# Altium schematic sheet Output_dig.SchDoc
size A4; DocumentNumber: 2; SheetNumber: 2; SheetTotal: 11
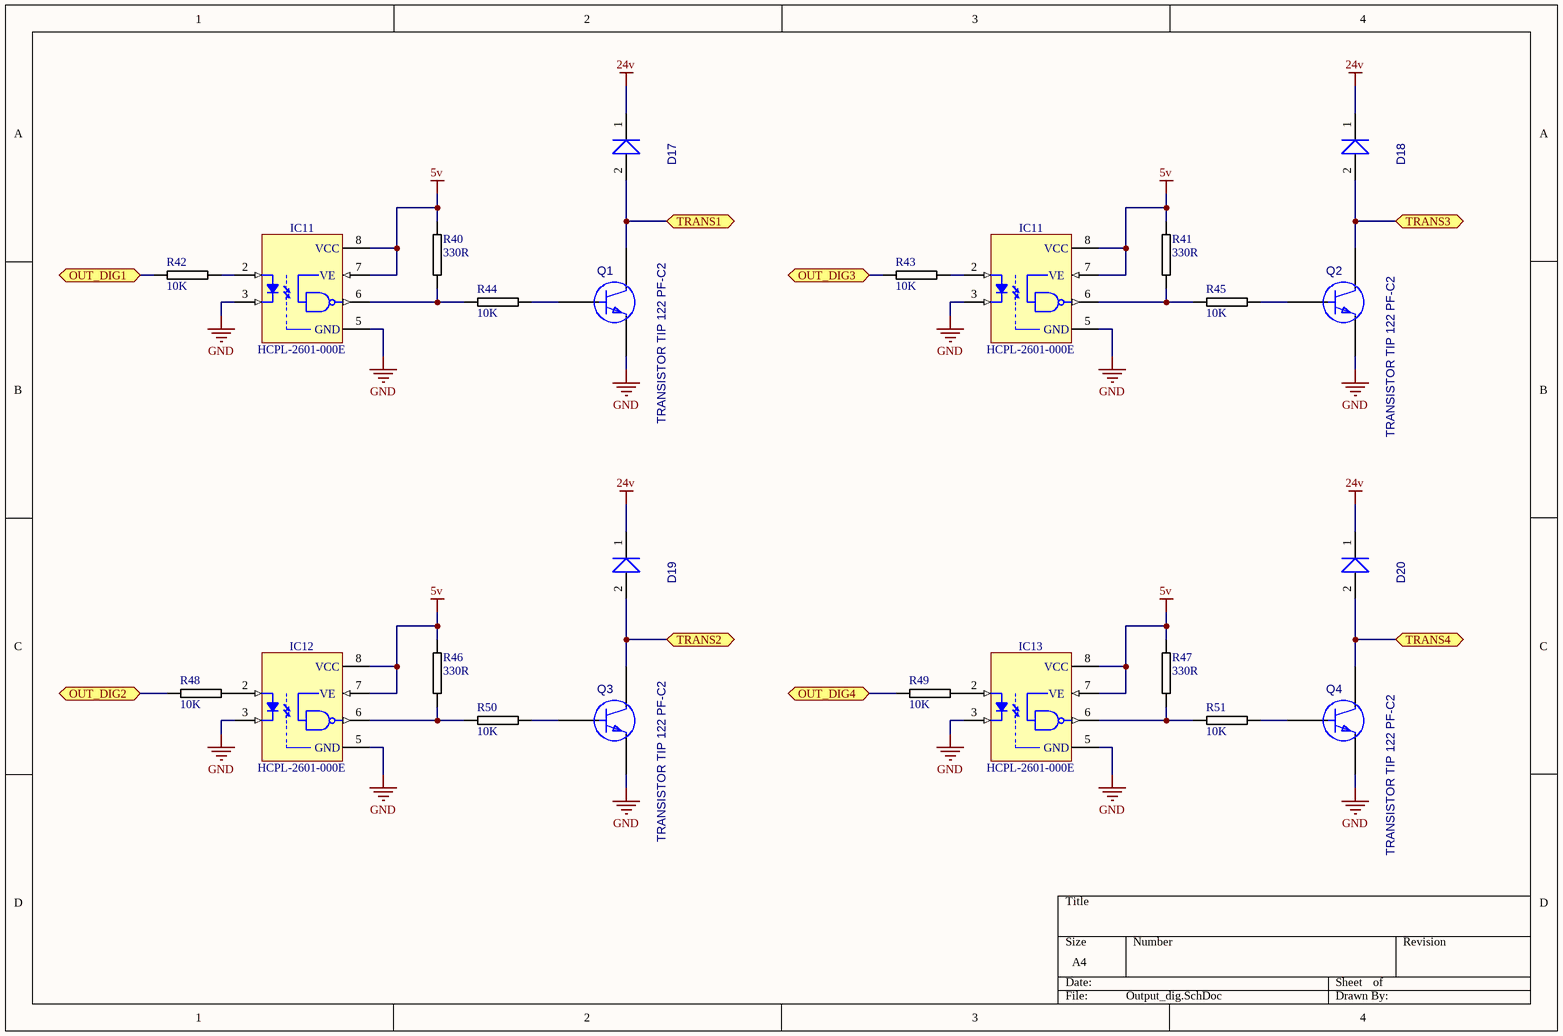
[diagram p0: Output_dig.SchDoc]

## Parts
(Parts that share a designator on the sheet are numbered #1, #2 ... from top to bottom, then left to right.)
D17  DIODO 1N4007 PF-B1  [DIODO DO41 PF-B1]  (value not drawn)
D18  DIODO 1N4007 PF-B1  [DIODO DO41 PF-B1]  (value not drawn)
D19  DIODO 1N4007 PF-B1  [DIODO DO41 PF-B1]  (value not drawn)
D20  DIODO 1N4007 PF-B1  [DIODO DO41 PF-B1]  (value not drawn)
IC11#1  HCPL-2601-000E  [DIP8-300]
IC11#2  HCPL-2601-000E  [DIP8-300]
IC12  HCPL-2601-000E  [DIP8-300]
IC13  HCPL-2601-000E  [DIP8-300]
Q1  TRANSISTOR TIP 122 PF-C2  [TRANSISTOR TO220 PF-C2]
Q2  TRANSISTOR TIP 122 PF-C2  [TRANSISTOR TO220 PF-C2]
Q3  TRANSISTOR TIP 122 PF-C2  [TRANSISTOR TO220 PF-C2]
Q4  TRANSISTOR TIP 122 PF-C2  [TRANSISTOR TO220 PF-C2]
R40  330R  [0805R-330]
R41  330R  [0805R-330]
R42  10K  [0805R-10K]
R43  10K  [0805R-10K]
R44  10K  [0805R-10K]
R45  10K  [0805R-10K]
R46  330R  [0805R-330]
R47  330R  [0805R-330]
R48  10K  [0805R-10K]
R49  10K  [0805R-10K]
R50  10K  [0805R-10K]
R51  10K  [0805R-10K]

## Ports
OUT_DIG1, OUT_DIG2, OUT_DIG3, OUT_DIG4, TRANS1, TRANS2, TRANS3, TRANS4

## Nets
5v: IC11#1.7(VE) IC11#1.8(VCC) IC11#2.7(VE) IC11#2.8(VCC) IC12.7(VE) IC12.8(VCC) IC13.7(VE) IC13.8(VCC) R40.1 R41.1 R46.1 R47.1
24v: D17.1(K) D18.1(K) D19.1(K) D20.1(K)
GND: IC11#1.3(K) IC11#1.5(GND) IC11#2.3(K) IC11#2.5(GND) IC12.3(K) IC12.5(GND) IC13.3(K) IC13.5(GND) Q1.3(E) Q2.3(E) Q3.3(E) Q4.3(E)
OUT_DIG1: R42.1 ; port OUT_DIG1
OUT_DIG2: R48.1 ; port OUT_DIG2
OUT_DIG3: R43.1 ; port OUT_DIG3
OUT_DIG4: R49.1 ; port OUT_DIG4
TRANS1: D17.2(A) Q1.2(C) ; port TRANS1
TRANS2: D19.2(A) Q3.2(C) ; port TRANS2
TRANS3: D18.2(A) Q2.2(C) ; port TRANS3
TRANS4: D20.2(A) Q4.2(C) ; port TRANS4
NetIC11#1_2: IC11#1.2(A) R42.2
NetIC11#1_6: IC11#1.6(VO) R40.2 R44.1
NetIC11#2_2: IC11#2.2(A) R43.2
NetIC11#2_6: IC11#2.6(VO) R41.2 R45.1
NetIC12_2: IC12.2(A) R48.2
NetIC12_6: IC12.6(VO) R46.2 R50.1
NetIC13_2: IC13.2(A) R49.2
NetIC13_6: IC13.6(VO) R47.2 R51.1
NetQ1_1: Q1.1(B) R44.2
NetQ2_1: Q2.1(B) R45.2
NetQ3_1: Q3.1(B) R50.2
NetQ4_1: Q4.1(B) R51.2

## Library data of the parts
D17-D20 = DIODO 1N4007 PF-B1: cod: 606000120; Compra: 302003193; 3D comp: DIODO DO41 PF-B1; Descri: DIODO 1N4007 PF-B1; SCH: DIODO 1N4007 PF-B1
IC11#1 IC11#2 IC12 IC13 = HCPL-2601-000E: Single Optocoupler; Part Description: High CMR, High Speed TTL Compatible Optocouplers; Manufacturer: AVAGO TECHNOLOGIES; Table: Optocouplers; Part Number: HCPL-2601-000E; Component Kind: Standard; Component Type: Standard; Device: HCPL-2601-000E; PackageDescription: DIP; 8 Leads; Row Spacing 7.62 mm; Pitch 2.54 mm; Manufacturer Part Number: HCPL-2601-000E; Pin Count: 8; Case: DIP8-300; Mounted: Yes; Socket: Yes; SMD: No; ComponentHeight: 4.7mm; HelpURL: \\cern.ch\dfs\Applications\Altium\Datasheets\HCPL-2601-000E.pdf; Author: CERN DEM JLC; CreateDate: 30/03/2009; LatestRevisionDate: 30/03/2009
Q1-Q4 = TRANSISTOR TIP 122 PF-C2: cod: 606000213; Compra: 302003328; 3D comp: TRANSISTOR TO220 PF-C2; Descri: TRANSISTOR TIP 122 PF-C2; SCH: TRANSISTOR TIP 122 PF-C2
R40 R41 R46 R47 = 0805R-330: RESISTOR 0805 1/4 WATT THIN FILM; Reel: *
R42-R45 R48-R51 = 0805R-10K: RESISTOR 0805 1/4 WATT THIN FILM; Reel: *